# Altium schematic sheet main.SchDoc
size A4; Organization: ORGANIZATION; Address1: ADDRESS 1; Address2: ADDRESS 2; Address3: ADDRESS 3; Address4: ADDRESS 4; Revision: -; SheetNumber: 1; SheetTotal: 3
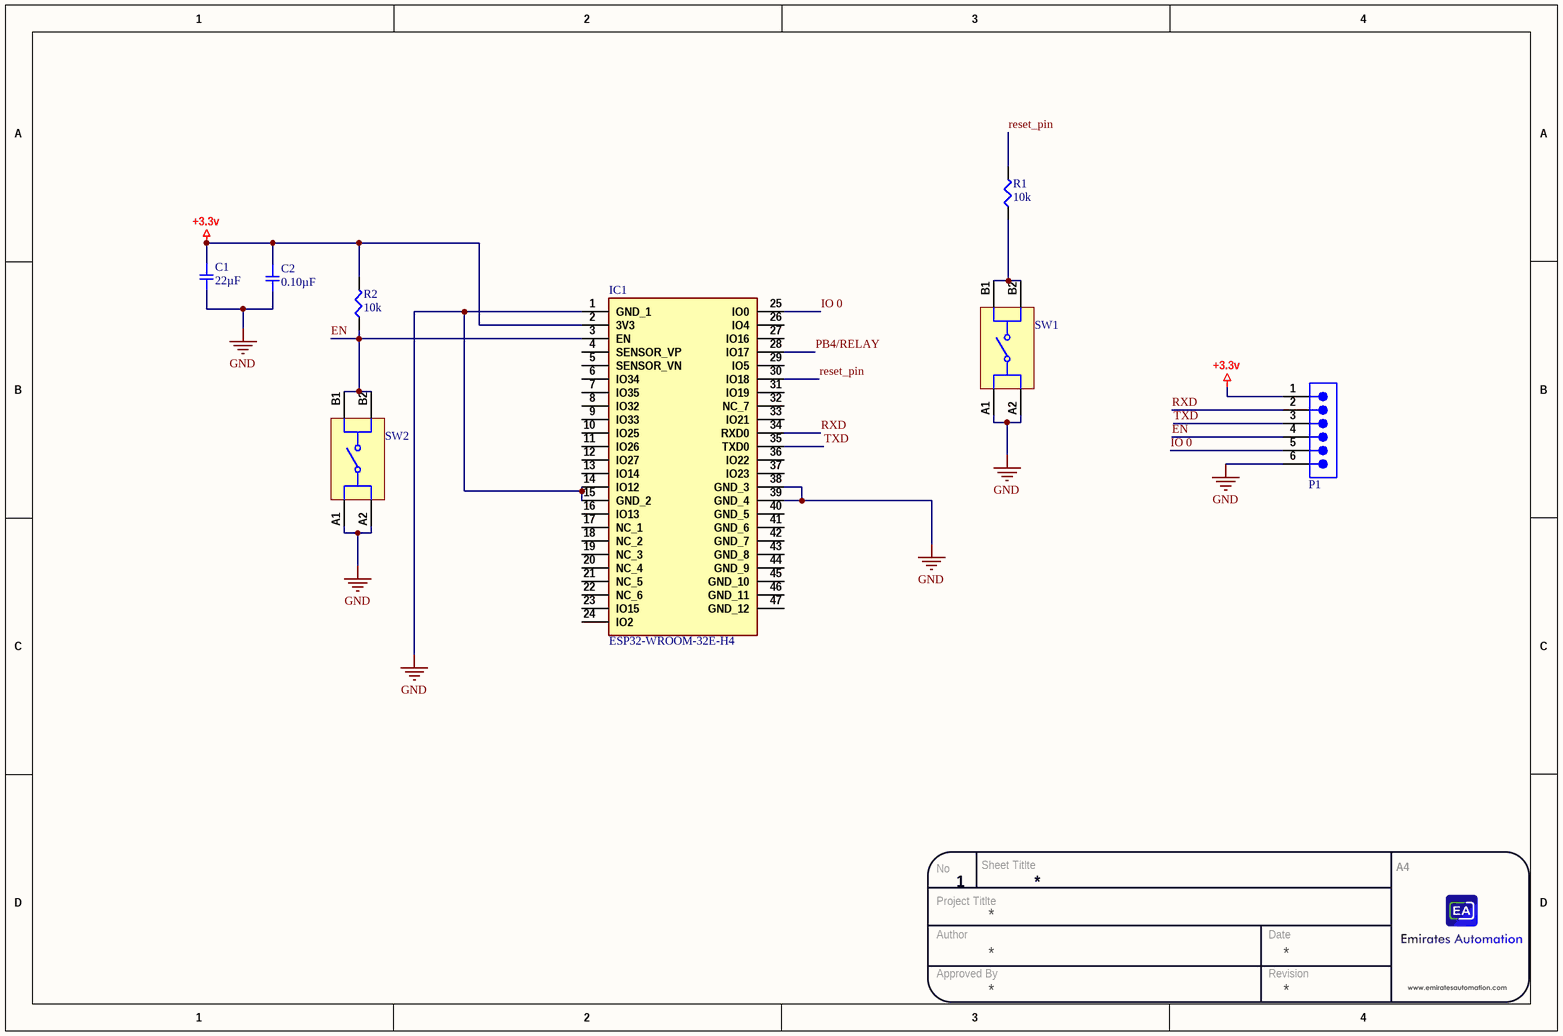
[diagram p0: main.SchDoc]

## Parts
C1  22µF  [SMD-0603C]
C2  0.10µF  [SMD-0603C]
IC1  ESP32-WROOM-32E-H4  [ESP32WROOM32UEM113EH2800UH3Q0]
P1  61300611121  [61300611121]  (value not drawn)
R1  10k  [SMD-0603-RES]
R2  10k  [SMD-0603-RES]
SW1  430476085716  [430476085716]  (value not drawn)
SW2  430476085716  [430476085716]  (value not drawn)

## Nets
+3.3v: C1.1 C2.1 IC1.2(3V3) P1.1 R2.2
GND: C1.2 C2.2 IC1.1(GND_1) IC1.14(IO12) IC1.15(GND_2) IC1.38(GND_3) IC1.39(GND_4) P1.6 SW1.A1 SW1.A2 SW2.A1 SW2.A2
EN: IC1.3(EN) P1.4 R2.1 SW2.B1 SW2.B2
IO 0: IC1.25(IO0) P1.5
PB4/RELAY: IC1.28(IO17)
reset_pin: IC1.30(IO18) R1.2
RXD: IC1.34(RXD0) P1.2
TXD: IC1.35(TXD0) P1.3
NetR1_1: R1.1 SW1.B1 SW1.B2

Not connected (* = marked no-connect by the designer): IC1 4(SENSOR_VP) 5(SENSOR_VN) 6(IO34) 7(IO35) 8(IO32) 9(IO33) 10(IO25) 11(IO26) 12(IO27) 13(IO14) 16(IO13) 17(NC_1) 18(NC_2) 19(NC_3) 20(NC_4) 21(NC_5) 22(NC_6) 23(IO15) 24(IO2) 26(IO4) 27(IO16) 29(IO5) 31(IO19) 32(NC_7) 33(IO21) 36(IO22) 37(IO23) 40(GND_5) 41(GND_6) 42(GND_7) 43(GND_8) 44(GND_9) 45(GND_10) 46(GND_11) 47(GND_12)

## Notes on the sheet
- No
- Project Titlte
- Sheet Titlte
- A4
- Author
- Approved By
- Date
- Revision

## Library data of the parts
C1 = GRM188R61A226ME15D: CAP CER 22UF 10V X5R 0603; Manufacturer: Murata Electronics North America; Factory Stock: 0; Unit Price (USD): 0.24; Minimum Quantity: 1; Tolerance: ±20%; Datasheets: http://www.murata.com/~/media/webrenewal/support/library/catalog/products/capacitor/mlcc/c02e.pdf; Image: //media.digikey.com/Renders/Murata%20Renders/ZRB-SERIES-0402.jpg; Digi-Key Part Number: 490-10476-1-ND; Part Number: GRM188R61A226ME15D; Quantity Available: 179406; @ qty: 0; Packaging: Cut Tape (CT); Series: GRM; Part Status: Active; Value: 22µF; Voltage: 10V; Temperature Coefficient: X5R; Operating Temperature: -55°C ~ 85°C; Features: Derating Recommended; Ratings: -; Applications: General Purpose; Mounting Type: Surface Mount, MLCC; Package / Case: 0603 (1608 Metric); Size / Dimension: 0.063" L x 0.031" W (1.60mm x 0.80mm); Height - Seated (Max): -; Thickness (Max): 0.039" (1.00mm); Lead Spacing: -; Lead Style: -
C2 = GCJ188R71C104KA01D: CAP CER 0.1UF 16V X7R 0603; Manufacturer: Murata Electronics North America; Factory Stock: 0; Unit Price (USD): 0.21; Minimum Quantity: 1; Tolerance: ±10%; Datasheets: http://www.murata.com/~/media/webrenewal/support/library/catalog/products/capacitor/mlcc/c03e.ashx; Image: //media.digikey.com/Renders/Murata%20Renders/0603%28LQG18%29.jpg; Digi-Key Part Number: 490-5796-1-ND; Part Number: GCJ188R71C104KA01D; Quantity Available: 22473; @ qty: 0; Packaging: Cut Tape (CT); Series: GCJ; Part Status: Active; Value: 0.10µF; Voltage: 16V; Temperature Coefficient: X7R; Operating Temperature: -55°C ~ 125°C; Features: Soft Termination; Ratings: AEC-Q200; Applications: Automotive, Boardflex Sensitive; Mounting Type: Surface Mount, MLCC; Package / Case: 0603 (1608 Metric); Size / Dimension: 0.063" L x 0.031" W (1.60mm x 0.80mm); Height - Seated (Max): -; Thickness (Max): 0.035" (0.90mm); Lead Spacing: -; Lead Style: -
IC1 = ESP32-WROOM-32E-H4: Integrated Circuit; Manufacturer_Name: Espressif Systems; Datasheet Link: https://www.espressif.com/sites/default/files/documentation/esp32-wroom-32e_esp32-wroom-32ue_datasheet_en.pdf; Height: 3.25mm; Manufacturer_Part_Number: ESP32-WROOM-32E-H4; Mouser Part Number: 356-ESP32WRM320EH3PS; Mouser Price/Stock: https://www.mouser.co.uk/ProductDetail/Espressif-Systems/ESP32-WROOM-32E-H4?qs=Li%252BoUPsLEnuUxeqGSCz%252BcA%3D%3D
P1 = 61300611121: WR-PHD Pin Header, THT, Vertical, pitch 2.54mm, 1 Row, 6P; Manufacturer: Wurth Elektronik; Contact Resistance: 20mΩ; Rated Current: 3A; Working Voltage: 250V; Withstanding Voltage: 500V; ComponentLink1Description: Website Link; ComponentLink1URL: https://www.we-online.com/redexpert/article/61300611121?ad; ComponentLink2Description: Datasheet Link; ComponentLink2URL: https://www.we-online.com/redexpert/spec/61300611121?ad; Manufacturer Part Number: 61300611121; Category: Board-to-Board Connectors; Match Code: WR-PHD; Mount: Through Hole; Operating Temperature Max: 105°C; Operating Temperature Min: -40°C; Packaging: Bag; Gender: Pin Header; Number of Pins: 6; Number of Rows: 1; Orientation: Vertical; Pitch: 2.54mm
R1 R2 = ERJ-3EKF1002V: RES SMD 10K OHM 1% 1/10W 0603; Manufacturer: Panasonic Electronic Components; Factory Stock: 0; Unit Price (USD): 0.00379; @ qty: 1500; Minimum Quantity: 1; Power (Watts): 0.1W, 1/10W; Temperature Coefficient: ±100ppm/°C; Part Number: ERJ-3EKF1002V; Datasheets: http://industrial.panasonic.com/www-cgi/jvcr13pz.cgi?E+PZ+3+AOA0002+ERJ3EKF1002V+7+WW; Image: //media.digikey.com/Photos/Panasonic%20Photos/MFG_ERJ-P6W%20Series.jpg; Digi-Key Part Number: P10.0KHCT-ND; Quantity Available: 6703141; Packaging: Cut Tape (CT); Series: ERJ; Part Status: Active; Value: 10k; Tolerance: ±1%; Composition: Thick Film; Features: Automotive AEC-Q200; Operating Temperature: -55°C ~ 155°C; Package / Case: 0603 (1608 Metric); Supplier Device Package: 0603; Size / Dimension: 0.063" L x 0.031" W (1.60mm x 0.80mm); Height - Seated (Max): 0.022" (0.55mm); Number of Terminations: 2; Failure Rate: -
SW1 SW2 = 430476085716: WS-TATV THT Washable Tact Switch 12x12mm, 160g, SPST-NO, 12V, 50mA; Manufacturer: Wurth Elektronik; Washable: Yes; Manufacturer Part Number: 430476085716; Category: Tact Switches; Match Code: WS-TATV; ComponentLink1Description: Website Link; ComponentLink1URL: https://www.we-online.com/redexpert/article/430476085716?ad; ComponentLink2Description: Datasheet Link; ComponentLink2URL: https://www.we-online.com/redexpert/spec/430476085716?ad; Mount: Through Hole; Operating Temperature Max: 85°C; Operating Temperature Min: -40°C; Packaging: Bulk; Length: 12mm; Width: 12mm; Height: 8.5mm; Circuit: SPST-NO; Contact Material: Stainless Steel; Contact Plating: Silver; Operation Force: 160g; Rated Current: 50mA; Rated Voltage (DC): 12V; Terminal Material: Copper Alloy; Terminal Plating: Silver